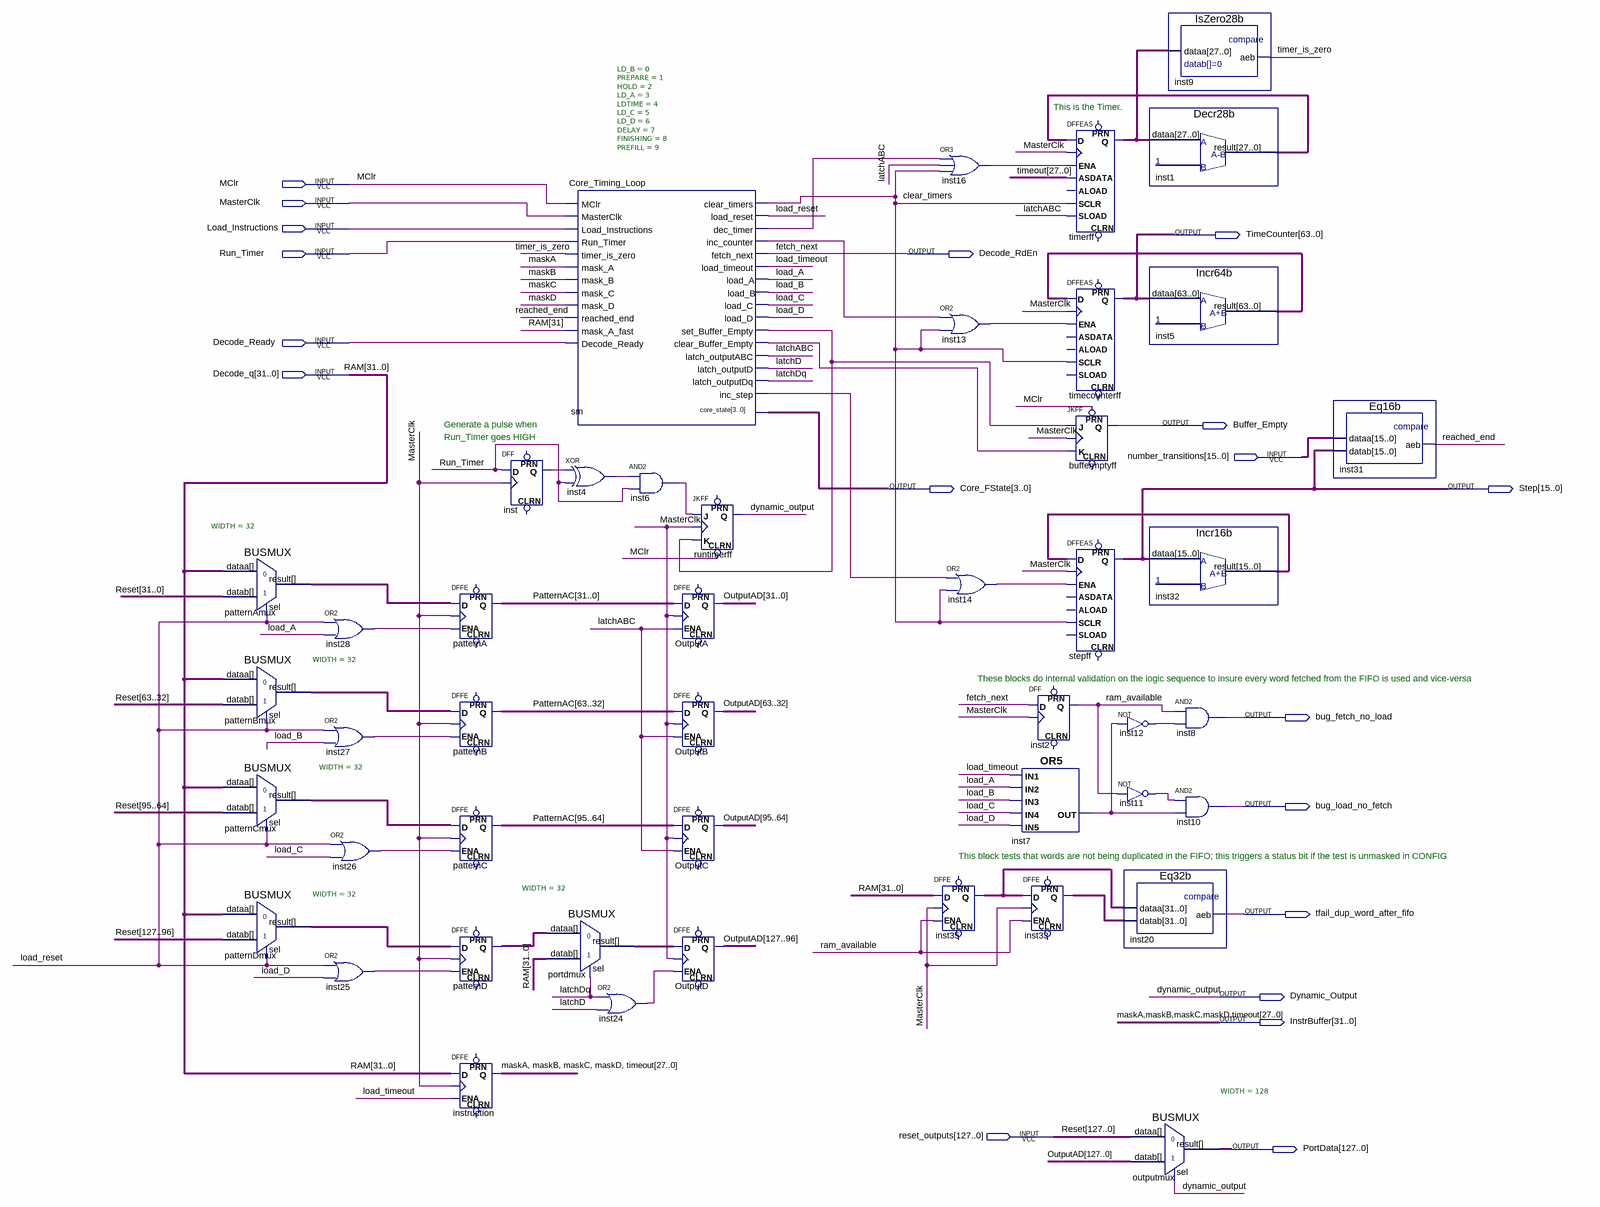
[diagram p0: schematic sheet]
// Quartus schematic TimingCore.bdf as structural Verilog: 46 symbols, 19 pins
module TimingCore (
  input  MClr,
  input  MasterClk,
  input  Load_Instructions,
  input  Run_Timer,
  input  Decode_Ready,
  input  [31:0] Decode_q,
  input  [15:0] number_transitions,
  input  [127:0] reset_outputs,
  output [63:0] TimeCounter,
  output Decode_RdEn,
  output Buffer_Empty,
  output [3:0] Core_FState,
  output [15:0] Step,
  output bug_fetch_no_load,
  output bug_load_no_fetch,
  output tfail_dup_word_after_fifo,
  output Dynamic_Output,
  output [31:0] InstrBuffer,
  output [127:0] PortData
);

  wire clear_timers, inst4_out, inst6_out, inst7_out, inst11_out, inst12_out, inst13_out, inst14_out,
       inst16_out, inst24_out, inst25_out, inst26_out, inst27_out, inst28_out, inst_q, latchABC, latchD,
       latchDq, load_A, load_B, load_C, load_D, load_reset, load_timeout, ram_available, reached_end,
       sm_clear_buffer_empty, sm_dec_timer, sm_inc_counter, sm_inc_step, sm_set_buffer_empty, timer_is_zero;
  wire [15:0] inst32_result;
  wire [27:0] inst1_result, timerff_q;
  wire [31:0] inst33_q, inst35_q, patternAmux_result, patternBmux_result, patternCmux_result, patternD_q,
       patternDmux_result, portdmux_result;
  wire [63:0] inst5_result;
  wire [95:0] PatternAC;
  wire [127:0] OutputAD;

  BUSMUX #(.WIDTH(32)) patternAmux (
    .datab(reset_outputs[31:0]), .sel(load_reset), .dataa(Decode_q), .result(patternAmux_result));
  BUSMUX #(.WIDTH(32)) patternBmux (
    .datab(reset_outputs[63:32]), .sel(load_reset), .dataa(Decode_q), .result(patternBmux_result));
  BUSMUX #(.WIDTH(32)) patternCmux (
    .datab(reset_outputs[95:64]), .sel(load_reset), .dataa(Decode_q), .result(patternCmux_result));
  BUSMUX #(.WIDTH(32)) patternDmux (
    .datab(reset_outputs[127:96]), .sel(load_reset), .dataa(Decode_q), .result(patternDmux_result));
  or inst28 (inst28_out, load_reset, load_A);
  or inst27 (inst27_out, load_reset, load_B);
  or inst26 (inst26_out, load_reset, load_C);
  or inst25 (inst25_out, load_reset, load_D);
  DFFE patternA[31:0] (
    .D(patternAmux_result), .CLK(MasterClk), .ENA(inst28_out), .Q(PatternAC[31:0]));  // open: PRN, CLRN
  DFFE patternB[31:0] (
    .D(patternBmux_result), .CLK(MasterClk), .ENA(inst27_out), .Q(PatternAC[63:32]));  // open: PRN, CLRN
  DFFE patternC[31:0] (
    .D(patternCmux_result), .CLK(MasterClk), .ENA(inst26_out), .Q(PatternAC[95:64]));  // open: PRN, CLRN
  DFFE patternD[31:0] (.D(patternDmux_result), .CLK(MasterClk), .ENA(inst25_out), .Q(patternD_q));  // open: PRN, CLRN
  DFFE instruction[31:0] (.D(Decode_q), .CLK(MasterClk), .ENA(load_timeout), .Q(InstrBuffer));  // open: PRN, CLRN
  DFF inst (.CLK(MasterClk), .D(Run_Timer), .Q(inst_q));  // open: CLRN, PRN
  Core_Timing_Loop #(.LD_B(0), .PREPARE(1), .HOLD(2), .LD_A(3), .LDTIME(4), .LD_C(5), .LD_D(6), .DELAY(7), .FINISHING(8), .PREFILL(9)) sm (
    .MClr(MClr), .MasterClk(MasterClk), .Load_Instructions(Load_Instructions), .Run_Timer(Run_Timer),
    .timer_is_zero(timer_is_zero), .mask_A(InstrBuffer[31]), .mask_B(InstrBuffer[30]),
    .mask_C(InstrBuffer[29]), .mask_D(InstrBuffer[28]), .reached_end(reached_end),
    .mask_A_fast(Decode_q[31]), .Decode_Ready(Decode_Ready), .clear_timers(clear_timers),
    .load_reset(load_reset), .dec_timer(sm_dec_timer), .inc_counter(sm_inc_counter),
    .fetch_next(Decode_RdEn), .load_timeout(load_timeout), .load_A(load_A), .load_B(load_B), .load_C(load_C),
    .load_D(load_D), .set_Buffer_Empty(sm_set_buffer_empty), .clear_Buffer_Empty(sm_clear_buffer_empty),
    .latch_outputABC(latchABC), .latch_outputD(latchD), .latch_outputDq(latchDq), .inc_step(sm_inc_step),
    .core_state(Core_FState));
  xor inst4 (inst4_out, inst_q, Run_Timer);
  BUSMUX #(.WIDTH(32)) portdmux (.datab(Decode_q), .sel(latchDq), .dataa(patternD_q), .result(portdmux_result));
  and inst6 (inst6_out, inst4_out, Run_Timer);
  or inst24 (inst24_out, latchDq, latchD);
  DFFE OutputA[31:0] (.D(PatternAC[31:0]), .CLK(MasterClk), .ENA(latchABC), .Q(OutputAD[31:0]));  // open: PRN, CLRN
  DFFE OutputB[31:0] (.D(PatternAC[63:32]), .CLK(MasterClk), .ENA(latchABC), .Q(OutputAD[63:32]));  // open: PRN, CLRN
  DFFE OutputC[31:0] (.D(PatternAC[95:64]), .CLK(MasterClk), .ENA(latchABC), .Q(OutputAD[95:64]));  // open: PRN, CLRN
  DFFE OutputD[31:0] (.D(portdmux_result), .CLK(MasterClk), .ENA(inst24_out), .Q(OutputAD[127:96]));  // open: PRN, CLRN
  JKFF runtimerff (
    .CLRN(MClr), .K(sm_set_buffer_empty), .J(inst6_out), .CLK(MasterClk), .Q(Dynamic_Output));  // open: PRN
  or inst16 (inst16_out, sm_dec_timer, latchABC, clear_timers);
  or inst13 (inst13_out, sm_inc_counter, clear_timers);
  DFFE inst35[31:0] (.D(Decode_q), .CLK(MasterClk), .ENA(ram_available), .Q(inst35_q));  // open: PRN, CLRN
  or inst14 (inst14_out, sm_inc_step, clear_timers);
  DFF inst2 (.CLK(MasterClk), .D(Decode_RdEn), .Q(ram_available));  // open: CLRN, PRN
  or inst7 (inst7_out, load_timeout, load_A, load_B, load_C, load_D);
  DFFE inst33[31:0] (.D(inst35_q), .CLK(MasterClk), .ENA(ram_available), .Q(inst33_q));  // open: PRN, CLRN
  DFFEAS timerff[27:0] (
    .ASDATA(InstrBuffer[27:0]), .ENA(inst16_out), .CLK(MasterClk), .D(inst1_result), .SCLR(clear_timers),
    .SLOAD(latchABC), .Q(timerff_q));  // open: PRN, ALOAD, CLRN
  DFFEAS timecounterff[63:0] (
    .ENA(inst13_out), .CLK(MasterClk), .D(inst5_result), .SCLR(clear_timers), .Q(TimeCounter));  // open: PRN, ALOAD, ASDATA, CLRN, SLOAD
  JKFF buffermptyff (
    .PRN(MClr), .K(sm_clear_buffer_empty), .J(sm_set_buffer_empty), .CLK(MasterClk), .Q(Buffer_Empty));  // open: CLRN
  DFFEAS stepff[15:0] (
    .ENA(inst14_out), .CLK(MasterClk), .D(inst32_result), .SCLR(clear_timers), .Q(Step));  // open: PRN, ALOAD, ASDATA, CLRN, SLOAD
  not inst12 (inst12_out, inst7_out);
  not inst11 (inst11_out, ram_available);
  Eq32b inst20 (.dataa(inst35_q), .datab(inst33_q), .aeb(tfail_dup_word_after_fifo));
  BUSMUX #(.WIDTH(128)) outputmux (.datab(OutputAD), .sel(Dynamic_Output), .dataa(reset_outputs), .result(PortData));
  IsZero28b inst9 (.dataa(timerff_q), .aeb(timer_is_zero));
  Decr28b inst1 (.dataa(timerff_q), .result(inst1_result));
  Incr64b inst5 (.dataa(TimeCounter), .result(inst5_result));
  Incr16b inst32 (.dataa(Step), .result(inst32_result));
  and inst8 (bug_fetch_no_load, ram_available, inst12_out);
  and inst10 (bug_load_no_fetch, inst11_out, inst7_out);
  Eq16b inst31 (.dataa(number_transitions), .datab(Step), .aeb(reached_end));

  // Other names for the same wires on the sheet: fetch_next = Decode_RdEn; maskA = InstrBuffer[31];
  //   maskB = InstrBuffer[30]; maskC = InstrBuffer[29]; maskD = InstrBuffer[28]; RAM[31:0] = Decode_q;
  //   Reset[127:0] = reset_outputs; timeout[27:0] = InstrBuffer[27:0]

  // Notes on the sheet:
  //   This is the Timer.
  //   Generate a pulse when
  //   Run_Timer goes HIGH
  //   These blocks do internal validation on the logic sequence to insure every word fetched from the FIFO is used and vice-versa
  //   This block tests that words are not being duplicated in the FIFO; this triggers a status bit if the test is unmasked in CONFIG
endmodule
